# Altium project KeypadHW10.PrjPcb
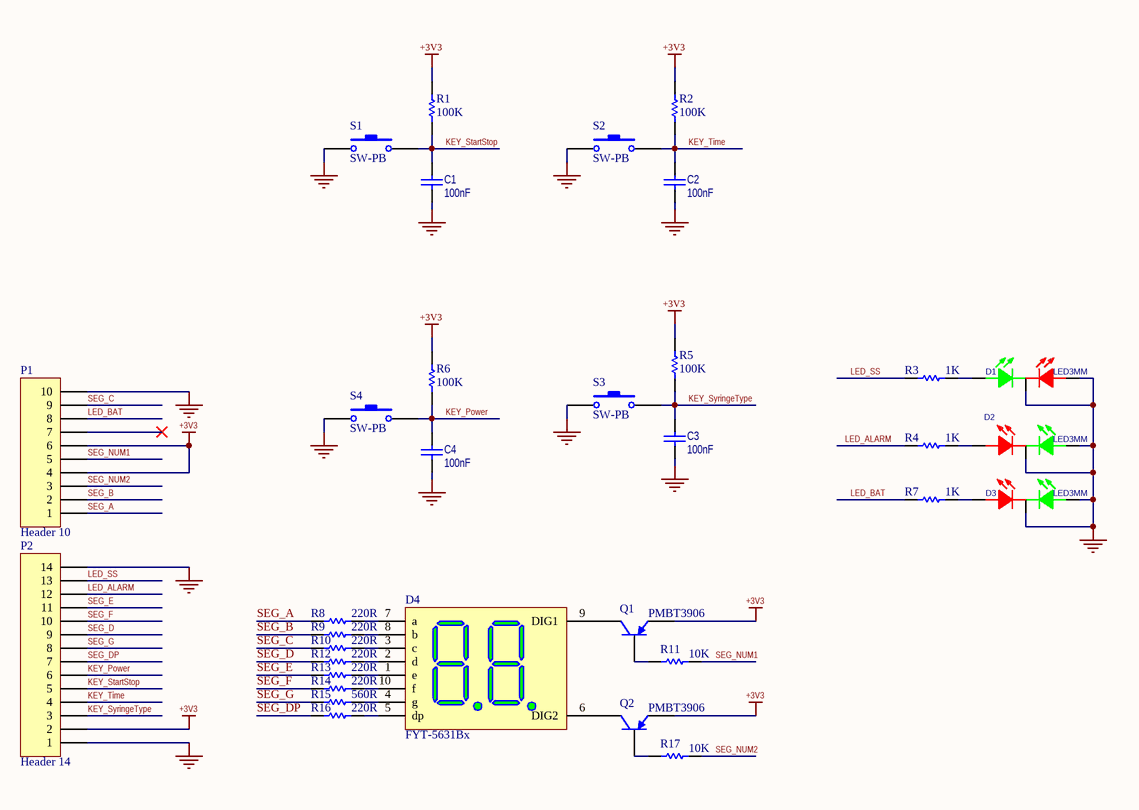
[diagram p0: KeypadHW10.SchDoc]
1 sheet, 33 parts. Net scope: global (net labels, ports and power ports of the same name join across sheets).
Board file: KeypadHW10.PcbDoc

## Sheet KeypadHW10.SchDoc
size A4

### Parts
C1  100nF  [CAP0805]
C2  100nF  [CAP0805]
C3  100nF  [CAP0805]
C4  100nF  [CAP0805]
D1  LED3MM  [LED3MM_R&G]
D2  LED3MM  [LED3MM_R&G]
D3  LED3MM  [LED3MM_R&G]
D4  FYT-5631Bx  [7SEG-2DIGIT-15x10]
P1  Header 10  [HDR_1x10-2mm]
P2  Header 14  [HDR_1x14-2mm]
Q1  PMBT3906  [SOT23_N]
Q2  PMBT3906  [SOT23_N]
R1  100K  [RES0805]
R2  100K  [RES0805]
R3  1K  [RES0805]
R4  1K  [RES0805]
R5  100K  [RES0805]
R6  100K  [RES0805]
R7  1K  [RES0805]
R8  220R  [RES0805]
R9  220R  [RES0805]
R10  220R  [RES0805]
R11  10K  [RES0805]
R12  220R  [RES0805]
R13  220R  [RES0805]
R14  220R  [RES0805]
R15  560R  [RES0805]
R16  220R  [RES0805]
R17  10K  [RES0805]
S1  SW-PB  [SW-4PIN]
S2  SW-PB  [SW-4PIN]
S3  SW-PB  [SW-4PIN]
S4  SW-PB  [SW-4PIN]

### Nets
+3V3: P1.4 P1.6 P2.2 Q1.2(E) Q2.2(E) R1.2 R2.2 R5.2 R6.2
GND: C1.1 C2.1 C3.1 C4.1 D1.2(CATHODE) D1.3(ANODER) D2.1(ANODEG) D2.2(CATHODE) D3.1(ANODEG) D3.2(CATHODE) P1.10 P2.1 P2.14 S1.1 S2.1 S3.1 S4.1
KEY_Power: C4.2 P2.6 R6.1 S4.2
KEY_StartStop: C1.2 P2.5 R1.1 S1.2
KEY_SyringeType: C3.2 P2.3 R5.1 S3.2
KEY_Time: C2.2 P2.4 R2.1 S2.2
LED_ALARM: P2.12 R4.1
LED_BAT: P1.8 R7.1
LED_SS: P2.13 R3.1
SEG_A: P1.1 R8.1
SEG_B: P1.2 R9.1
SEG_C: P1.9 R10.1
SEG_D: P2.9 R12.1
SEG_DP: P2.7 R16.1
SEG_E: P2.11 R13.1
SEG_F: P2.10 R14.1
SEG_G: P2.8 R15.1
SEG_NUM1: P1.5 R11.2
SEG_NUM2: P1.3 R17.2
NetD1_1: D1.1(ANODEG) R3.2
NetD2_3: D2.3(ANODER) R4.2
NetD3_3: D3.3(ANODER) R7.2
NetD4_1: D4.1(e) R13.2
NetD4_2: D4.2(d) R12.2
NetD4_3: D4.3(c) R10.2
NetD4_4: D4.4(g) R15.2
NetD4_5: D4.5(dp) R16.2
NetD4_6: D4.6(DIG2) Q2.3(C)
NetD4_7: D4.7(a) R8.2
NetD4_8: D4.8(b) R9.2
NetD4_9: D4.9(DIG1) Q1.3(C)
NetD4_10: D4.10(f) R14.2
NetQ1_1: Q1.1(B) R11.1
NetQ2_1: Q2.1(B) R17.1

Not connected (* = marked no-connect by the designer): P1 7*

### Library data of the parts
C1-C4 = Cap: Capacitor; Published: 8-Jun-2000; LatestRevisionDate: 17-Jul-2002; LatestRevisionNote: Re-released for DXP Platform.; PackageReference: RAD-0.3; Publisher: Altium Limited; PackageDescription: Radial Cap, Thru-Hole; 2 Leads; 0.3 in Pin Spacing; Value: 100nF
D1-D3 = LED_2C_CC: LED BICOLOR CC; Designer: Abbas Basereh; Data: 16-12-2016; Link: *; Part.No: *
D4 = 7SEG-2DIGIT-10PIN: CA-3digit-7Seg-10PIN
P1 = Header 10: Header, 10-Pin; LatestRevisionDate: 17-Jul-2002; LatestRevisionNote: Re-released for DXP Platform.; Publisher: Altium Limited
P2 = Header 14: Header, 14-Pin; LatestRevisionDate: 17-Jul-2002; LatestRevisionNote: Re-released for DXP Platform.; Publisher: Altium Limited
Q1 Q2 = PMBT3906: PNP Switching Transistor; Published: 17-Sep-2003; LatestRevisionDate: 12-Dec-2006; LatestRevisionNote: IPC-7351 Footprint Added.; DatasheetVersion: 27-Apr-1999; PackageVersion: May-1999; PackageReference: SOT23; Publisher: Altium Limited; PackageDescription: 3-Pin SOT-23 Package 0.95 mm Pitch, 2.3 mm Lead Span; ComponentLink1Description: Manufacturer Link; ComponentLink1URL: http://www.semiconductors.philips.com/; ComponentLink2Description: Datasheet; ComponentLink2URL: http://www.semiconductors.philips.com/acrobat/datasheets/PMBT3906_4.pdf
R1-R17 = Res Semi: Semiconductor Resistor; Published: 8-Jun-2000; LatestRevisionDate: 17-Jul-2002; LatestRevisionNote: Re-released for DXP Platform.; PackageReference: AXIAL-0.5; Publisher: Altium Limited; PackageDescription: Axial Device, Thru-Hole; 2 Leads; 0.5 in Pin Spacing
  R1 R2 R5 R6: Value: 100K
  R3 R4 R7: Value: 1K
  R8-R10 R12-R14 R16: Value: 220R
  R11 R17: Value: 10K
  R15: Value: 560R
S1-S4 = SW-PB: Switch; Published: 24-Mar-1999; LatestRevisionDate: 17-Jul-2002; LatestRevisionNote: Re-released for DXP Platform.; PackageReference: SPST-2; Publisher: Altium Limited; PackageDescription: Switch; 2 Leads